# Altium schematic sheet RF-UNIT_NEW.SCHDOC: RF-UNIT
size A4; DocumentNumber: 13; Revision: 1.8.2; SheetNumber: 13; SheetTotal: 19
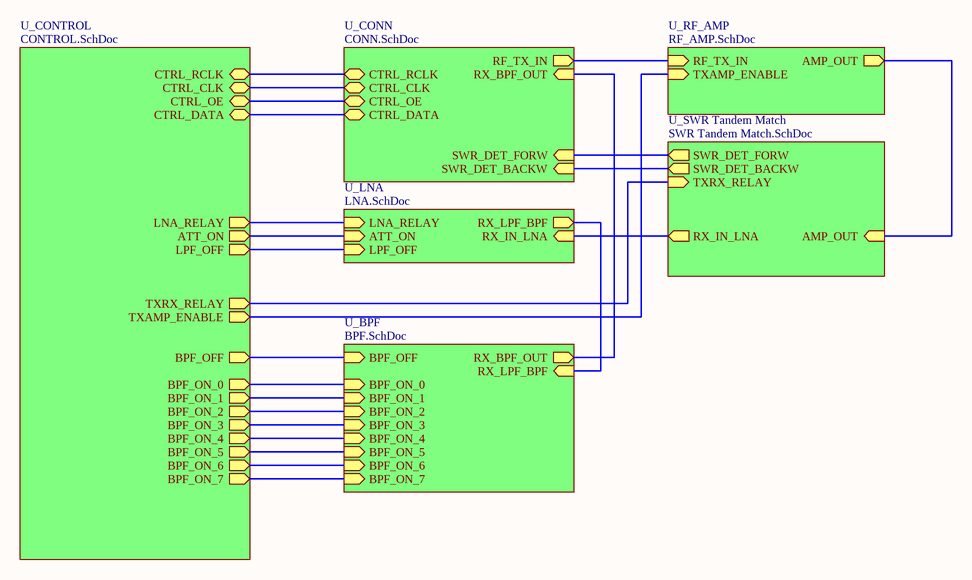
[diagram p0: RF-UNIT_NEW.SCHDOC]

## Sub-sheets
U_BPF = BPF.SchDoc: RX_LPF_BPF (in), RX_BPF_OUT (out), BPF_OFF (in), BPF_ON_0 (in), BPF_ON_1 (in), BPF_ON_2 (in), BPF_ON_3 (in), BPF_ON_4 (in), BPF_ON_5 (in), BPF_ON_6 (in), BPF_ON_7 (in)
U_CONN = CONN.SchDoc: RX_BPF_OUT (in), RF_TX_IN (out), CTRL_RCLK (bidir), CTRL_CLK (bidir), CTRL_OE (bidir), CTRL_DATA (bidir), SWR_DET_FORW (in), SWR_DET_BACKW (in)
U_CONTROL = CONTROL.SchDoc: TXRX_RELAY (out), LNA_RELAY (out), TXAMP_ENABLE (out), CTRL_RCLK (bidir), CTRL_CLK (bidir), CTRL_OE (bidir), CTRL_DATA (bidir), BPF_OFF (out), ATT_ON (out), LPF_OFF (out), BPF_ON_0 (out), BPF_ON_1 (out), BPF_ON_2 (out), BPF_ON_3 (out), BPF_ON_4 (out), BPF_ON_5 (out), BPF_ON_6 (out), BPF_ON_7 (out)
U_LNA = LNA.SchDoc: LNA_RELAY (in), RX_IN_LNA (in), ATT_ON (in), LPF_OFF (in), RX_LPF_BPF (out)
U_RF_AMP = RF_AMP.SchDoc: RF_TX_IN (in), TXAMP_ENABLE (in), AMP_OUT (out)
U_SWR Tandem Match = SWR Tandem Match.SchDoc: TXRX_RELAY (in), SWR_DET_FORW (out), SWR_DET_BACKW (out), RX_IN_LNA (out), AMP_OUT (in)

## Nets
(unnamed): sheet U_CONTROL/TXRX_RELAY, sheet U_SWR Tandem Match/TXRX_RELAY
(unnamed): sheet U_CONTROL/LNA_RELAY, sheet U_LNA/LNA_RELAY
(unnamed): sheet U_CONTROL/TXAMP_ENABLE, sheet U_RF_AMP/TXAMP_ENABLE
(unnamed): sheet U_CONTROL/CTRL_RCLK, sheet U_CONN/CTRL_RCLK
(unnamed): sheet U_CONTROL/CTRL_CLK, sheet U_CONN/CTRL_CLK
(unnamed): sheet U_CONTROL/CTRL_OE, sheet U_CONN/CTRL_OE
(unnamed): sheet U_CONTROL/CTRL_DATA, sheet U_CONN/CTRL_DATA
(unnamed): sheet U_CONTROL/BPF_OFF, sheet U_BPF/BPF_OFF
(unnamed): sheet U_CONTROL/ATT_ON, sheet U_LNA/ATT_ON
(unnamed): sheet U_CONTROL/LPF_OFF, sheet U_LNA/LPF_OFF
(unnamed): sheet U_CONTROL/BPF_ON_0, sheet U_BPF/BPF_ON_0
(unnamed): sheet U_CONTROL/BPF_ON_1, sheet U_BPF/BPF_ON_1
(unnamed): sheet U_CONTROL/BPF_ON_2, sheet U_BPF/BPF_ON_2
(unnamed): sheet U_CONTROL/BPF_ON_3, sheet U_BPF/BPF_ON_3
(unnamed): sheet U_CONTROL/BPF_ON_4, sheet U_BPF/BPF_ON_4
(unnamed): sheet U_CONTROL/BPF_ON_5, sheet U_BPF/BPF_ON_5
(unnamed): sheet U_CONTROL/BPF_ON_6, sheet U_BPF/BPF_ON_6
(unnamed): sheet U_CONTROL/BPF_ON_7, sheet U_BPF/BPF_ON_7
(unnamed): sheet U_RF_AMP/RF_TX_IN, sheet U_CONN/RF_TX_IN
(unnamed): sheet U_RF_AMP/AMP_OUT, sheet U_SWR Tandem Match/AMP_OUT
(unnamed): sheet U_CONN/RX_BPF_OUT, sheet U_BPF/RX_BPF_OUT
(unnamed): sheet U_CONN/SWR_DET_FORW, sheet U_SWR Tandem Match/SWR_DET_FORW
(unnamed): sheet U_CONN/SWR_DET_BACKW, sheet U_SWR Tandem Match/SWR_DET_BACKW
(unnamed): sheet U_BPF/RX_LPF_BPF, sheet U_LNA/RX_LPF_BPF
(unnamed): sheet U_LNA/RX_IN_LNA, sheet U_SWR Tandem Match/RX_IN_LNA

## Notes on the sheet
- Title
- Size:
- Date:
- A4
- Number:
- Time:
- Revision:
- Sheet
- of
- File: